# Altium schematic sheet EMG.SchDoc
size A4
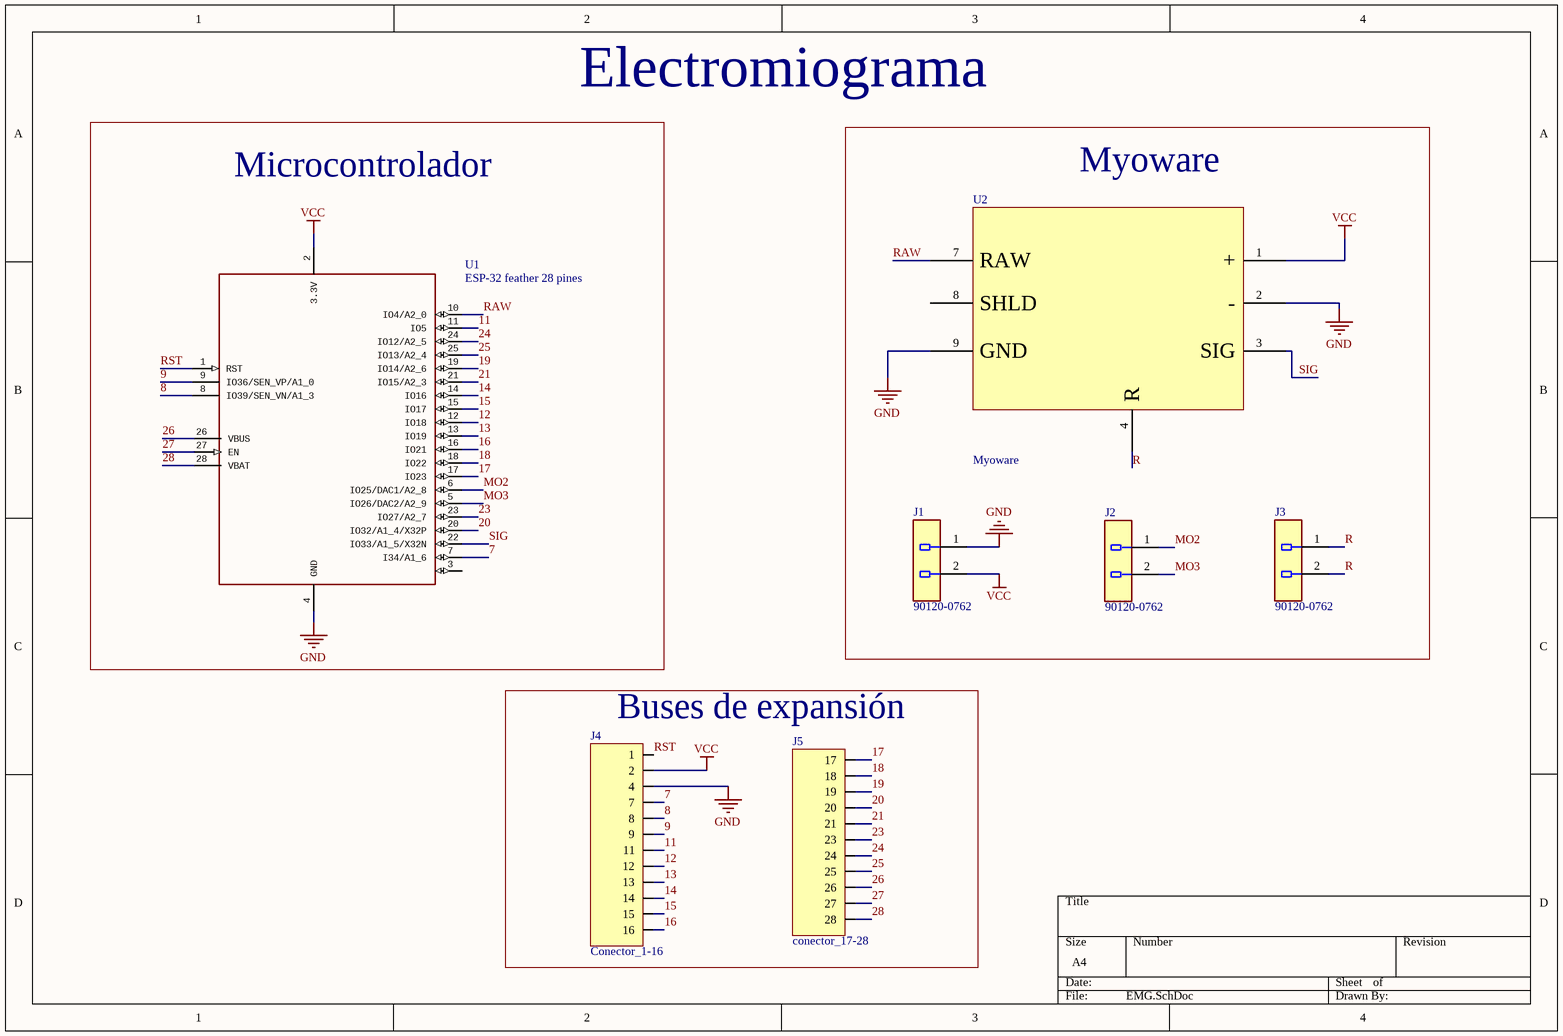
[diagram p0: EMG.SchDoc]

## Parts
J1  Part Number: 90120-0762  [Molex_90120-0762_0]  (hidden comment: Conn_Molex_90120-0762_eec)
J2  Part Number: 90120-0762  [Molex_90120-0762_0]  (hidden comment: Conn_Molex_90120-0762_eec)
J3  Part Number: 90120-0762  [Molex_90120-0762_0]  (hidden comment: Conn_Molex_90120-0762_eec)
J4  Conector_1-16  [PCBComponent_1]
J5  conector_17-28  [PCBComponent_1]
U1  ESP-32 feather 28 pines  [ESP32-Feather-footprint_v3]
U2  Myoware  [Myoware_footprint_v4]

## Blocks framed on the sheet
Microcontrolador: U1
Myoware: J1-J3 U2
Buses de expansión: J4 J5

## Nets
GND: J1.1 J4.4 U1.4(GND) U2.2(-) U2.9(GND)
VCC: J1.2 J4.2 U1.2(3.3V) U2.1(+)
7: J4.7 U1.7(I34/A1_6)
8: J4.8 U1.8(IO39/SEN_VN/A1_3)
9: J4.9 U1.9(IO36/SEN_VP/A1_0)
11: J4.11 U1.11(IO5)
12: J4.12 U1.12(IO18)
13: J4.13 U1.13(IO19)
14: J4.14 U1.14(IO16)
15: J4.15 U1.15(IO17)
16: J4.16 U1.16(IO21)
17: J5.17 U1.17(IO23)
18: J5.18 U1.18(IO22)
19: J5.19 U1.19(IO14/A2_6)
20: J5.20 U1.20(IO32/A1_4/X32P)
21: J5.21 U1.21(IO15/A2_3)
23: J5.23 U1.23(IO27/A2_7)
24: J5.24 U1.24(IO12/A2_5)
25: J5.25 U1.25(IO13/A2_4)
26: J5.26 U1.26(VBUS)
27: J5.27 U1.27(EN)
28: J5.28 U1.28(VBAT)
MO2: J2.1 U1.6(IO25/DAC1/A2_8)
MO3: J2.2 U1.5(IO26/DAC2/A2_9)
R: J3.1 J3.2 U2.4(R)
RAW: U1.10(IO4/A2_0) U2.7(RAW)
RST: J4.1 U1.1(RST)
SIG: U1.22(IO33/A1_5/X32N) U2.3(SIG)

Not connected (* = marked no-connect by the designer): U1 3; U2 8(SHLD)

## Notes on the sheet
- Electromiograma

## Library data of the parts
J1-J3 = Conn_Molex_90120-0762_eec: CONN HEADER 2POS .100" STR GOLD; Manufacturer: Molex; helpURL: https://upverter.com/upn/revision/2e8a16f42ccfe3ab/; ComponentLink2Description: Datasheet; Temperature: -55°C to +125°C; Package: CONN_PTH_HDR2; Supplier 2: Mouser; Supplier 1: Digi-Key; ComponentLink1URL: https://upverter.com/upn/revision/2e8a16f42ccfe3ab/; Supplier Part Number 2: 538-90120-0762; Supplier Part Number 1: WM8084-ND; ComponentLink1Description: Upverter; ComponentLink2URL: http://www.molex.com/pdm_docs/sd/901200761_sd.pdf; RoHS: TRUE; Mouser Part Number: 538-90120-0762; Temperature Range High: +125°C; Digikey Description: CONN HEADER 2POS .100" STR GOLD; Digikey Part Number: WM8084-ND; Temperature Range Low: -55°C; Lead Free: yes
U1 = ESP32-Feather